# EAGLE schematic PID-Demo (EAGLE 9.7.0)
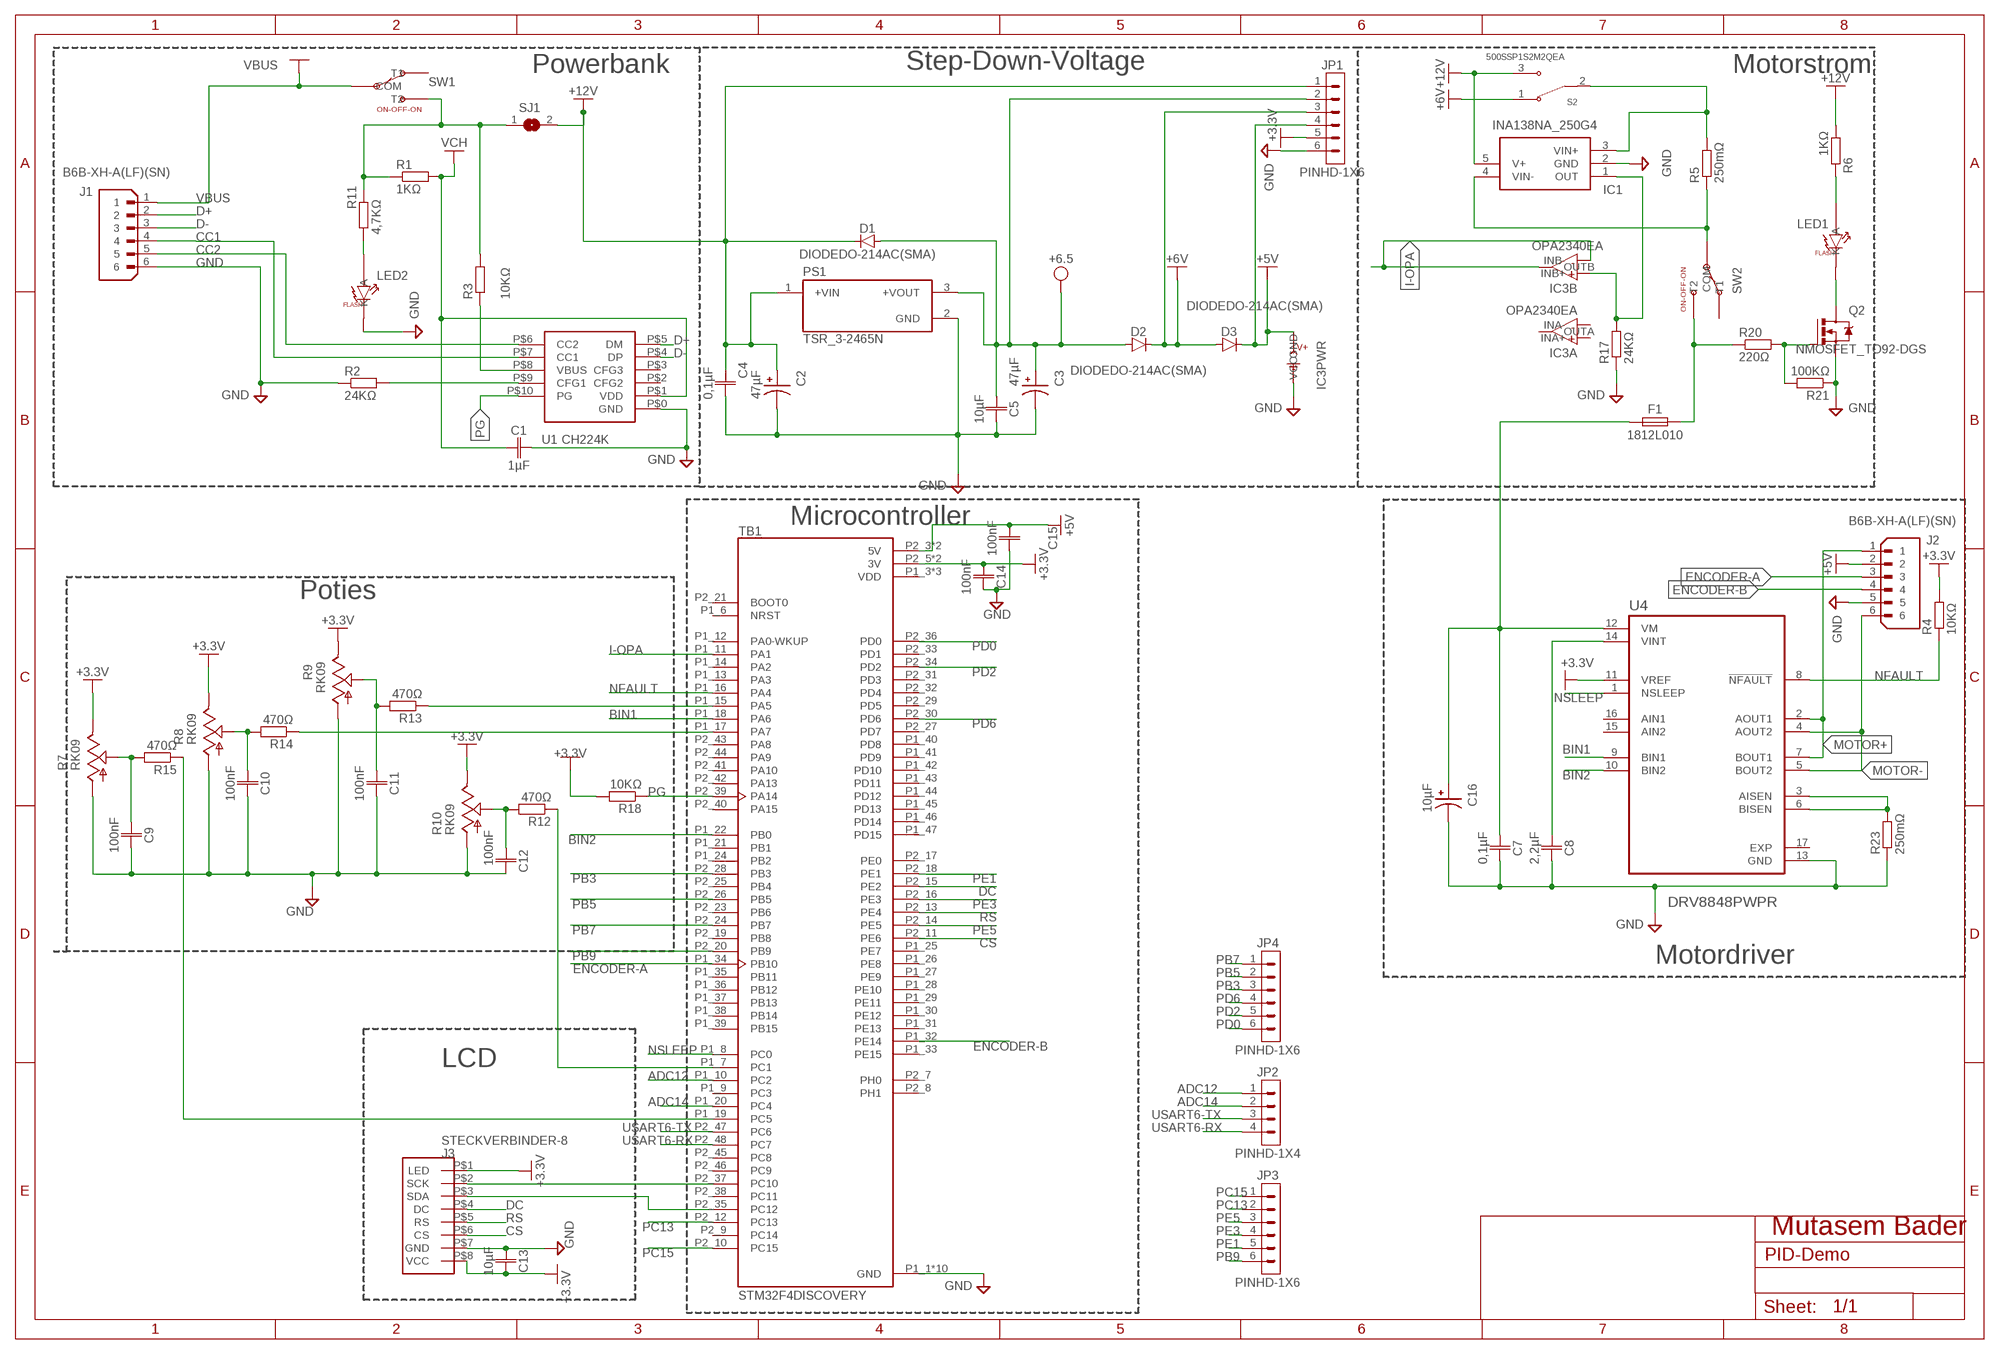
[diagram p0: schematic, sheet 1]

## Parts
C1  1µF  C_CHIP-1206(3216-METRIC)  [CAPC3216X135]
C2  47µF  EEUEB1H470SH  [CAPPRD250W50D630H1120]
C3  47µF  EEUEB1H470SH  [CAPPRD250W50D630H1120]
C4  0,1µF  C_CHIP-1206(3216-METRIC)  [CAPC3216X135]
C5  10µF  C_CHIP-1206(3216-METRIC)  [CAPC3216X135]
C7  0,1µF  C_CHIP-1206(3216-METRIC)  [CAPC3216X135]
C8  2,2µF  C_CHIP-1206(3216-METRIC)  [CAPC3216X135]
C9  100nF  C_CHIP-1206(3216-METRIC)  [CAPC3216X135]
C10  100nF  C_CHIP-1206(3216-METRIC)  [CAPC3216X135]
C11  100nF  C_CHIP-1206(3216-METRIC)  [CAPC3216X135]
C12  100nF  C_CHIP-1206(3216-METRIC)  [CAPC3216X135]
C13  10µF  C_CHIP-1206(3216-METRIC)  [CAPC3216X135]
C14  100nF  C_CHIP-1206(3216-METRIC)  [CAPC3216X135]
C15  100nF  C_CHIP-1206(3216-METRIC)  [CAPC3216X135]
C16  10µF  EEUEB1H100S  [CAPPRD200W50D500H1100]
D1  DIODEDO-214AC(SMA)  [DIOM5226X290N]
D2  DIODEDO-214AC(SMA)  [DIOM5226X290N]
D3  DIODEDO-214AC(SMA)  [DIOM5226X290N]
F1  1812L010  [FUSC4532X125]
IC1  INA138NA_250G4  [SOT95P280X145-5N]
IC3  OPA2340EA  [VSSOP-8-DGK]
J1  B6B-XH-A(LF)(SN)  [JST_B6B-XH-A(LF)(SN)]
J2  B6B-XH-A(LF)(SN)  [JST_B6B-XH-A(LF)(SN)]
J3  STECKVERBINDER-8  [STECKEVERINDER-8]
JP1  PINHD-1X6  [1X06]
JP2  PINHD-1X4  [1X04]
JP3  PINHD-1X6  [1X06]
JP4  PINHD-1X6  [1X06]
LED1  19060001-PANEL  [CML-19060001-PANEL-M8]
LED2  19060001-PANEL  [CML-19060001-PANEL-M8]
PS1  TSR_3-2465N  [CONV_TSR_3-2465N]
Q2  NMOSFET_TO92-DGS  [TO92]
R1  1KΩ  R_CHIP-1206(3216-METRIC)  [RESC3216X70]
R2  24KΩ  R_CHIP-1206(3216-METRIC)  [RESC3216X70]
R3  10KΩ  R_CHIP-1206(3216-METRIC)  [RESC3216X70]
R4  10KΩ  R_CHIP-1206(3216-METRIC)  [RESC3216X70]
R5  250mΩ  R_CHIP-1206(3216-METRIC)  [RESC3216X70]
R6  1KΩ  R_CHIP-1206(3216-METRIC)  [RESC3216X70]
R7  RK09  [RK09]
R8  RK09  [RK09]
R9  RK09  [RK09]
R10  RK09  RK09K1130A6S  [RK09K1130A6S]
R11  4,7KΩ  R_CHIP-1206(3216-METRIC)  [RESC3216X70]
R12  470Ω  R_CHIP-1206(3216-METRIC)  [RESC3216X70]
R13  470Ω  R_CHIP-1206(3216-METRIC)  [RESC3216X70]
R14  470Ω  R_CHIP-1206(3216-METRIC)  [RESC3216X70]
R15  470Ω  R_CHIP-1206(3216-METRIC)  [RESC3216X70]
R17  24KΩ  R_CHIP-1206(3216-METRIC)  [RESC3216X70]
R18  10KΩ  R_CHIP-1206(3216-METRIC)  [RESC3216X70]
R20  220Ω  R_CHIP-1206(3216-METRIC)  [RESC3216X70]
R21  100KΩ  R_CHIP-1206(3216-METRIC)  [RESC3216X70]
R23  250mΩ  R_CHIP-1206(3216-METRIC)  [RESC3216X70]
S2  500SSP1S2M2QEA  [SW_500SSP1S2M2QEA]
SJ1  SJ  [SJ]
SW1  10022-PANEL  [GOOBAY-10022-PANEL]
SW2  10022-PANEL  [GOOBAY-10022-PANEL]
TB1  STM32F4DISCOVERY  [MODULE_STM32F4DISCOVERY]
U1  CH224K  [CH224K]
U4  DRV8848PWPR  [IC_DRV8848PWPR]

## Nets
+3.3V: C13.2 C14.1 J3.P$1(LED) J3.P$8(VCC) JP1.5 R4.2 R7.A R8.A R9.A R10.A R18.2 TB1.P2_5(3V) TB1.P2_6(3V) U4.11(VREF)
+5V: C15.1 D3.1(C) IC3.8(PWR:VCC) J2.2 JP1.4 TB1.P2_3(5V) TB1.P2_4(5V)
+6.5: C3.P C5.1 D1.2(A) D2.2(A) JP1.2 PS1.3(+VOUT)
+6V: D2.1(C) D3.2(A) JP1.3 S2.1(NC)
+12V: C2.P C4.1 D1.1(C) IC1.5(V+) JP1.1 PS1.1(+VIN) R6.1 S2.3(NO) SJ1.2
ADC12: JP2.1 TB1.P1_10(PC2)
ADC14: JP2.2 TB1.P1_20(PC4)
BIN1: TB1.P1_18(PA6) U4.9(BIN1)
BIN2: TB1.P1_22(PB0) U4.10(BIN2)
CC1: J1.4 U1.P$7(CC1)
CC2: J1.5 U1.P$6(CC2)
CS: J3.P$6(CS) TB1.P2_11(PE6)
D+: J1.2 U1.P$5(DM)
D-: J1.3 U1.P$4(DP)
DC: J3.P$4(DC) TB1.P2_15(PE2)
ENCODER-A: J2.3 TB1.P1_34(PB10)
ENCODER-B: J2.4 TB1.P1_32(PE14)
GND: C1.2 C2.N C3.N C4.2 C5.2 C7.2 C8.2 C9.2 C10.2 C11.2 C12.2 C13.1 C14.2 C15.2 C16.N IC1.2(GND) IC3.4(PWR:GND) J1.6 J2.5 J3.P$7(GND) JP1.6 LED2.2(K) PS1.2(GND) Q2.3(S) R2.1 R7.E R8.E R9.E R10.E R17.1 R21.1 R23.1 TB1.P1_1(GND) TB1.P1_2(GND) TB1.P1_5(GND) TB1.P1_23(GND) TB1.P1_49(GND) TB1.P1_50(GND) TB1.P2_1(GND) TB1.P2_2(GND) TB1.P2_49(GND) TB1.P2_50(GND) U1.P$0(GND) U4.13(GND)
I-OPA: IC3.6(B:INB-) IC3.7(B:OUTB) TB1.P1_11(PA1)
MOTOR+: J2.1 U4.2(AOUT1) U4.7(BOUT1)
MOTOR-: J2.6 U4.4(AOUT2) U4.5(BOUT2)
N$1: R3.1 U1.P$8(VBUS)
N$2: R2.2 U1.P$9(CFG1)
N$5: C8.1 U4.14(VINT)
N$8: C11.1 R9.S R13.2
N$10: Q2.2(G) R20.2 R21.2
N$11: IC1.4(VIN-) R5.1 SW2.2(COM)
N$13: LED1.1(A) R6.2
N$14: F1.2 R20.1 SW2.3(T2)
N$15: R23.2 U4.3(AISEN) U4.6(BISEN)
N$17: IC1.1(OUT) IC3.5(B:INB+) R17.2
N$18: IC1.3(VIN+) R5.2 S2.2(COM)
N$19: C10.1 R8.S R14.2
N$20: C9.1 R7.S R15.2
N$21: R12.1 TB1.P1_7(PC1)
N$22: C12.1 R10.S R12.2
N$23: R15.1 TB1.P1_19(PC5)
N$31: R13.1 TB1.P1_15(PA5)
N$32: LED2.1(A) R11.1
N$33: R1.1 R3.2 R11.2 SJ1.1 SW1.3(T2)
N$34: C7.1 C16.P F1.1 U4.12(VM)
N$36: R14.1 TB1.P1_17(PA7)
N$37: LED1.2(K) Q2.1(D)
NFAULT: R4.1 TB1.P1_16(PA4) U4.8(!NFAULT)
NSLEEP: TB1.P1_8(PC0) U4.1(NSLEEP)
PB3: JP4.3 TB1.P2_28(PB3)
PB5: JP4.2 TB1.P2_26(PB5)
PB7: JP4.1 TB1.P2_24(PB7)
PB9: JP3.6 TB1.P2_20(PB9)
PC13: JP3.2 TB1.P2_12(PC13)
PC15: JP3.1 TB1.P2_10(PC15)
PD0: JP4.6 TB1.P2_36(PD0)
PD2: JP4.5 TB1.P2_34(PD2)
PD6: JP4.4 TB1.P2_30(PD6)
PE1: JP3.5 TB1.P2_18(PE1)
PE3: JP3.4 TB1.P2_16(PE3)
PE5: JP3.3 TB1.P2_14(PE5)
PG: R18.1 TB1.P2_39(PA14) U1.P$10(PG)
RS: J3.P$5(RS) TB1.P2_13(PE4)
SCK: J3.P$2(SCK) TB1.P2_37(PC10)
SDA: J3.P$3(SDA) TB1.P2_35(PC12)
USART6-RX: JP2.4 TB1.P2_48(PC7)
USART6-TX: JP2.3 TB1.P2_47(PC6)
VBUS: J1.1 SW1.2(COM)
VCH: C1.1 R1.2 U1.P$1(VDD)
Unconnected: IC3.1(A:OUTA) IC3.2(A:INA-) IC3.3(A:INA+) SW1.1(T1) SW2.1(T1) TB1.P1_6(NRST) TB1.P1_9(PC3) TB1.P1_12(PA0-WKUP) TB1.P1_13(PA3) TB1.P1_14(PA2) TB1.P1_21(PB1) TB1.P1_24(PB2) TB1.P1_25(PE7) TB1.P1_26(PE8) TB1.P1_27(PE9) TB1.P1_28(PE10) TB1.P1_29(PE11) TB1.P1_30(PE12) TB1.P1_31(PE13) TB1.P1_33(PE15) TB1.P1_35(PB11) TB1.P1_36(PB12) TB1.P1_37(PB13) TB1.P1_38(PB14) TB1.P1_39(PB15) TB1.P1_40(PD8) TB1.P1_41(PD9) TB1.P1_42(PD10) TB1.P1_43(PD11) TB1.P1_44(PD12) TB1.P1_45(PD13) TB1.P1_46(PD14) TB1.P1_47(PD15) TB1.P2_7(PH0) TB1.P2_8(PH1) TB1.P2_9(PC14) TB1.P2_17(PE0) TB1.P2_19(PB8) TB1.P2_21(BOOT0) TB1.P2_23(PB6) TB1.P2_25(PB4) TB1.P2_27(PD7) TB1.P2_29(PD5) TB1.P2_31(PD3) TB1.P2_32(PD4) TB1.P2_33(PD1) TB1.P2_38(PC11) TB1.P2_40(PA15) TB1.P2_41(PA10) TB1.P2_42(PA13) TB1.P2_43(PA8) TB1.P2_44(PA9) TB1.P2_45(PC8) TB1.P2_46(PC9) U1.P$2(CFG2) U1.P$3(CFG3) U4.15(AIN2) U4.16(AIN1) U4.17(EXP)

## Notes on the sheet
- Powerbank | Motorstrom
- Step-Down-Voltage
- Microcontroller
- Poties
- Motordriver
- LCD
- Mutasem Bader

## Power pins joined to a net without a drawn wire
VDD: TB1.P1_3(VDD) TB1.P1_4(VDD) TB1.P2_22(VDD)

## Library data of the parts
C1 C4 C5 C7-C15 = Capacitor:C: Capacitor - Generic
C2 C3 = EEUEB1H470SH:EEUEB1H470SH: Check availability <https://pricing.snapeda.com/parts/EEUEB1H470SH/Panasonic/view-part?ref=eda>
C16 = EEUEB1H100S:EEUEB1H100S: Check availability <https://pricing.snapeda.com/parts/EEUEB1H100S/Panasonic/view-part?ref=eda>
D1-D3 = Diode:DIODE: Diode Rectifier - Generic
F1 = Fuse:1812L: 1812L Series PTC provides surface mount overcurrent protection for applications where resettable protection is desired. Datasheet <https://www.littelfuse.com/assetdocs/resettable-ptcs-1812l-datasheet?assetguid=ca5c80cb-504e-4a8a-8e74-0107520a1717>
IC1 = INA138NA_250G4:INA138NA_250G4: High-Side Measurement CURRENT SHUNT MONITOR Source: Datasheet <http://www.ti.com/lit/ds/symlink/ina138.pdf>
IC3 = TI_OPA2340EA:OPA2340EA: Texas Instruments OPA2340EA — Dual Rail-to-Rail Op-Amp, VSSOP-8 Single-supply, rail-to-rail CMOS, 2,5–5,5 V, GBW 5,5 MHz, SR 6 V/µs, IQ 750 µA/Kanal. Temperaturbereich: −40°C bis +85°C (spezifiziert), −55°C bis +125°C (Betrieb). Gehäuse: VSSOP-8 (DGK), 3,0 × 3,0 mm, JEDEC MO-187, MSL Level-2-260°C-1 Year. Datenblatt: SBOS073C | Reichelt: 188939 | TI MPN: OPA2340EA/250 Pin-Belegung (Package DGK0008A): 1=OUT_A 2=IN-_A 3=IN+_A 4=V- 5=IN+_B 6=IN-_B 7=OUT_B 8=V+ Alle Package-Maße direkt aus TI-Datenblatt SBOS073C, 4214862/A 04/2023 (keine Schätzungen).
J1 J2 = B6B-XH-A_LF__SN_:B6B-XH-A(LF)(SN): Check availability <https://pricing.snapeda.com/parts/B6B-XH-A%28LF%29%28SN%29/JST%20Sales%20America%20Inc./view-part?ref=eda>
J3 = Steckverbinder-8:STECKVERBINDER-8
JP1 JP3 JP4 = Connector:PINHD-1X6: Pin Header
JP2 = Connector:PINHD-1X4: Pin Header
LED1 LED2 = CML_19060001:19060001: CML Innovative Technologies 19060001 LED-Signalleuchte, Grün blinkend, 3,5–13 V DC, eingebauter Blinkoszillator. Gewinde: M8 x 0,75 | Hex: SW10 | Körper: 11,5 mm | Blende: ø9,5 mm Anschlüsse: 2 Drahtleitungen (Anode 12 mm, Kathode 14 mm) Pitch: 2,54 mm GESCHÄTZT — vor Serienfertigung bei CML bestätigen IP40 | RoHS | Reichelt-Art.-Nr. 271929
PS1 = TSR-3N:TSR_3-2465N: Check availability <https://pricing.snapeda.com/parts/TSR%203-2465N/Traco%20Power/view-part?ref=eda>
Q2 = Transistor:NMOSFET: N-Channel MOSFET - Generic
R1-R6 R11-R15 R17 R18 R20 R21 R23 = Resistor:R: Resistor Fixed - Generic
R7-R9 = RK09:RK09: Check availability <https://pricing.snapeda.com/parts/RK09K1130A6S/ALPS/view-part?ref=eda>
R10 = RK09:RK09K1130A6S: Check availability <https://pricing.snapeda.com/parts/RK09K1130A6S/ALPS/view-part?ref=eda>
S2 = 500SSP1S2M2QEA:500SSP1S2M2QEA: Check availability <https://pricing.snapeda.com/parts/500SSP1S2M2QEA/e-switch%20inc/view-part?ref=eda>
SJ1 = jumper:SJ: SMD solder JUMPER
SW1 SW2 = GOOBAY_10022:10022: Goobay / Wentronic 10022 Miniatur-Kippschalter EIN-AUS-EIN (SPDT ON-OFF-ON), 3 A / 250 V AC. Anschluss: 3 Lötösen | Farbe: Blau/Silber | RoHS Gehäuse: 8 x 12,9 x 33 mm | Montage: Panelbohrung 6,5 mm Pin-Pitch: 4,70 mm (GESCHÄTZT aus M1QE-Referenz — bei Wentronic bestätigen) Reichelt-Art.-Nr.: 285989 | EAN: 4040849100222
TB1 = STM32F4DISCOVERY:STM32F4DISCOVERY: Check availability <https://pricing.snapeda.com/parts/STM32F4DISCOVERY/STMicroelectronics/view-part?ref=eda>
U1 = CH224K:CH224K
U4 = DRV8848PWPR:DRV8848PWPR: Check availability <https://pricing.snapeda.com/parts/DRV8848PWPR/Texas%20Instruments/view-part?ref=eda>